# EAGLE schematic 8-Fach-PCB v26 (EAGLE 9.7.0)
Assembly variants: top, bottom
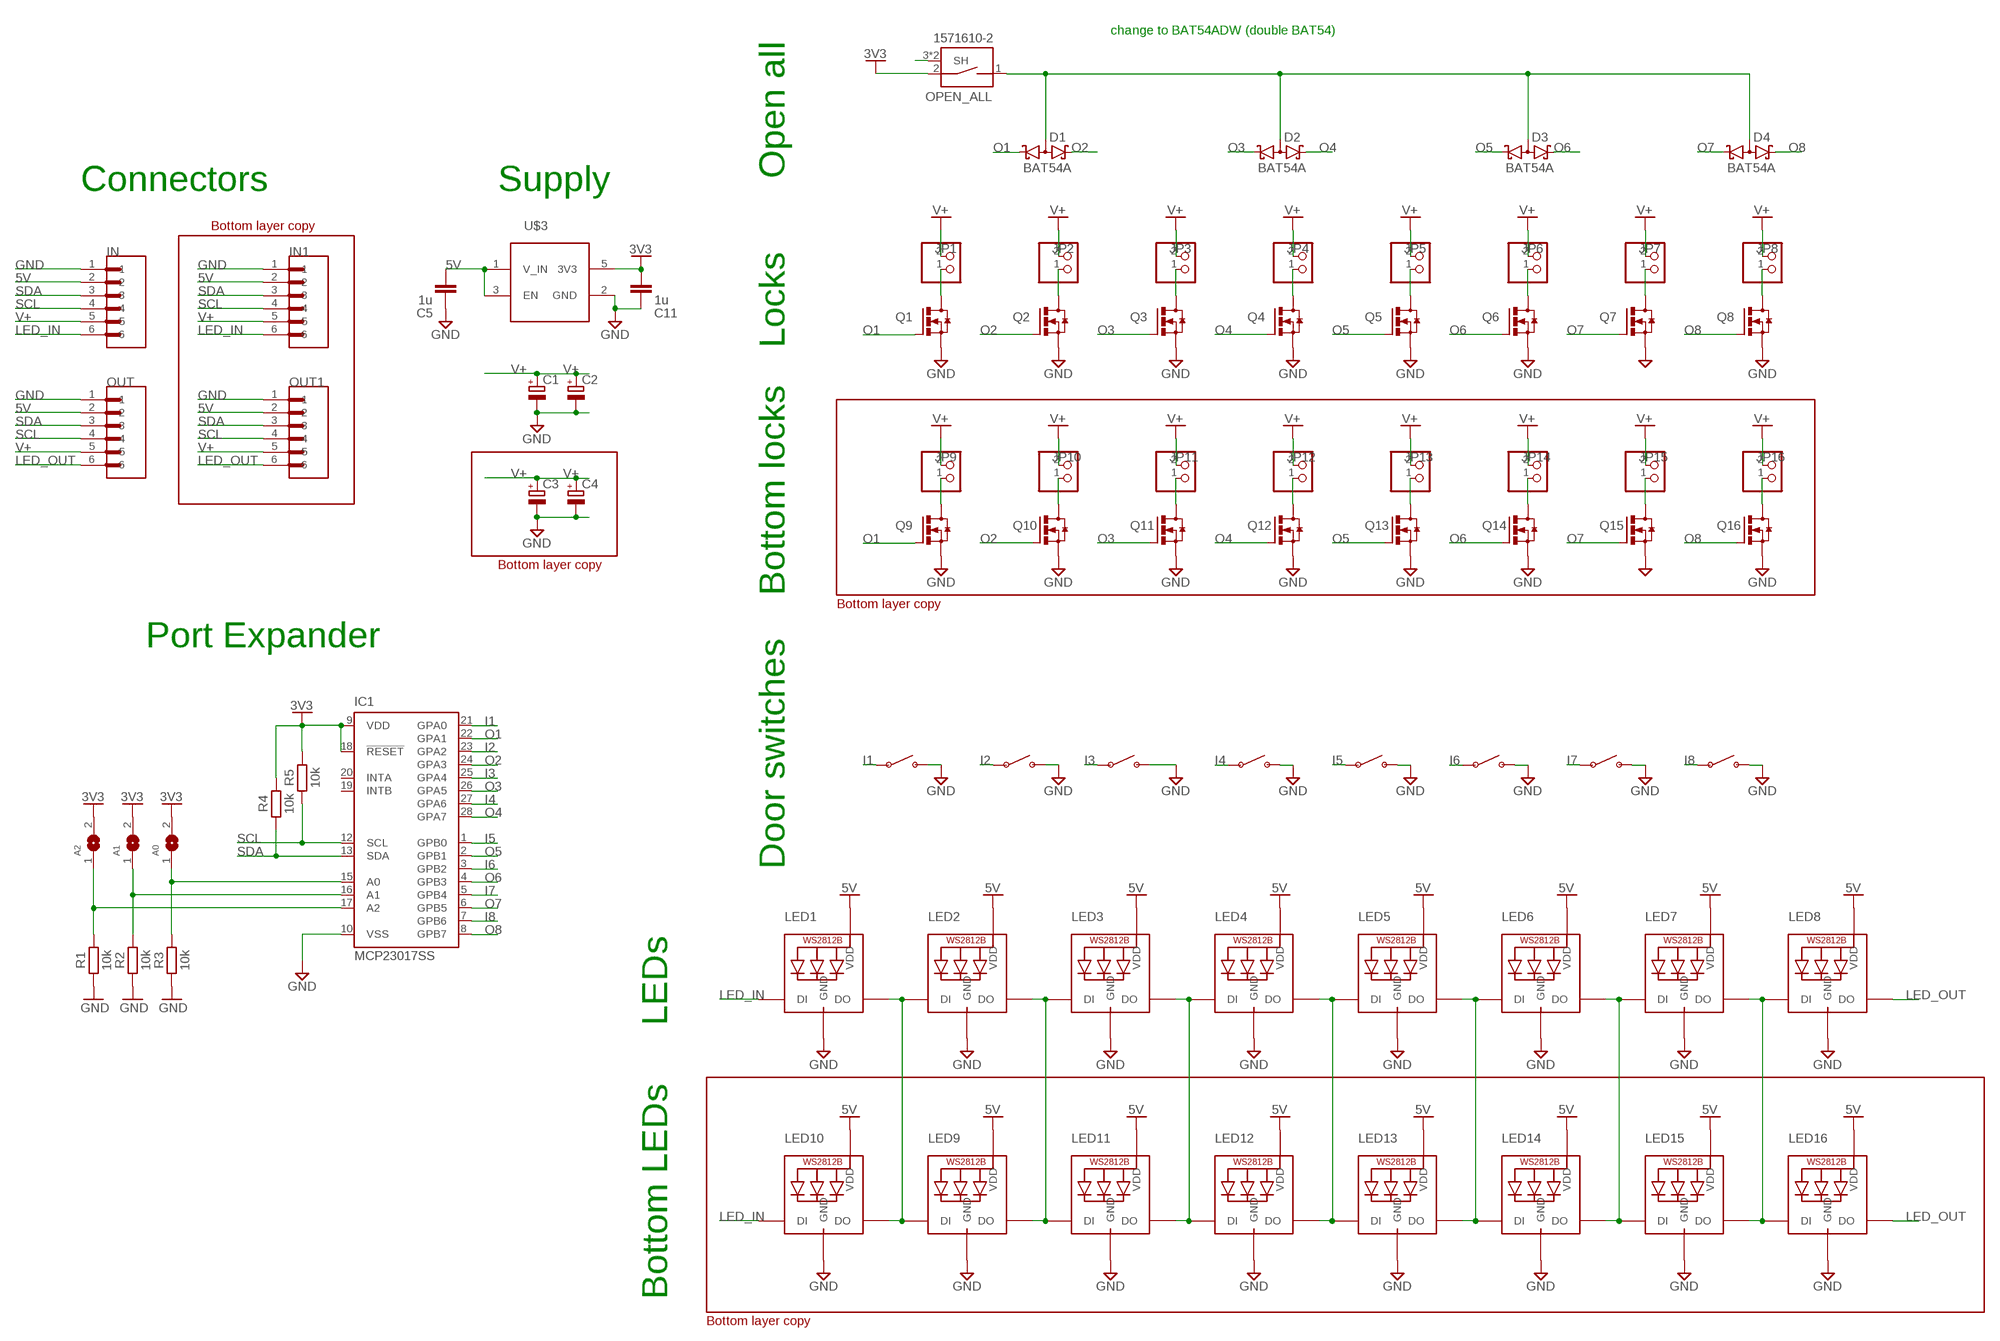
[diagram p0: schematic, sheet 1]

## Parts
A0  SOLDERJUMPER  [SOLDERJUMPER_ARROW_NOPASTE]
A1  SOLDERJUMPER  [SOLDERJUMPER_ARROW_NOPASTE]
A2  SOLDERJUMPER  [SOLDERJUMPER_ARROW_NOPASTE]
C1  C-POL_ECAP-8.5MM  [CAPAE830X1050N]  (not fitted in variant bottom)
C2  C-POL_ECAP-8.5MM  [CAPAE830X1050N]  (not fitted in variant bottom)
C3  C-POL_ECAP-8.5MM  [CAPAE830X1050N]  (not fitted in variant top)
C4  C-POL_ECAP-8.5MM  [CAPAE830X1050N]  (not fitted in variant top)
C5  1u  C_CHIP-0603(1608-METRIC)  [CAPC1608X85]
C11  1u  C_CHIP-0603(1608-METRIC)  [CAPC1608X85]
D1  BAT54A  [SOT23]
D2  BAT54A  [SOT23]
D3  BAT54A  [SOT23]
D4  BAT54A  [SOT23]
IC1  MCP23017SS  [SSOP28]
IN  B6B-PH-SM4-TB(LF)(SN)  [JST_B6B-PH-SM4-TB(LF)(SN)]  (not fitted in variant bottom)
IN1  B6B-PH-SM4-TB(LF)(SN)  [JST_B6B-PH-SM4-TB(LF)(SN)]  (not fitted in variant top)
JP1  JST_2PIN-SMT  [JST-PH-2-SMT]  (not fitted in variant bottom)
JP2  JST_2PIN-SMT  [JST-PH-2-SMT]  (not fitted in variant bottom)
JP3  JST_2PIN-SMT  [JST-PH-2-SMT]  (not fitted in variant bottom)
JP4  JST_2PIN-SMT  [JST-PH-2-SMT]  (not fitted in variant bottom)
JP5  JST_2PIN-SMT  [JST-PH-2-SMT]  (not fitted in variant bottom)
JP6  JST_2PIN-SMT  [JST-PH-2-SMT]  (not fitted in variant bottom)
JP7  JST_2PIN-SMT  [JST-PH-2-SMT]  (not fitted in variant bottom)
JP8  JST_2PIN-SMT  [JST-PH-2-SMT]  (not fitted in variant bottom)
JP9  JST_2PIN-SMT  [JST-PH-2-SMT]  (not fitted in variant top)
JP10  JST_2PIN-SMT  [JST-PH-2-SMT]  (not fitted in variant top)
JP11  JST_2PIN-SMT  [JST-PH-2-SMT]  (not fitted in variant top)
JP12  JST_2PIN-SMT  [JST-PH-2-SMT]  (not fitted in variant top)
JP13  JST_2PIN-SMT  [JST-PH-2-SMT]  (not fitted in variant top)
JP14  JST_2PIN-SMT  [JST-PH-2-SMT]  (not fitted in variant top)
JP15  JST_2PIN-SMT  [JST-PH-2-SMT]  (not fitted in variant top)
JP16  JST_2PIN-SMT  [JST-PH-2-SMT]  (not fitted in variant top)
LED1  SK6812  [4020]
LED2  SK6812  [4020]
LED3  SK6812  [4020]
LED4  SK6812  [4020]
LED5  SK6812  [4020]
LED6  SK6812  [4020]
LED7  SK6812  [4020]
LED8  SK6812  [4020]
LED9  SK6812  [4020]  (not fitted in variant top)
LED10  SK6812  [4020]  (not fitted in variant top)
LED11  SK6812  [4020]  (not fitted in variant top)
LED12  SK6812  [4020]  (not fitted in variant top)
LED13  SK6812  [4020]  (not fitted in variant top)
LED14  SK6812  [4020]  (not fitted in variant top)
LED15  SK6812  [4020]  (not fitted in variant top)
LED16  SK6812  [4020]  (not fitted in variant top)
OPEN_ALL  1571610-2  [1571610-2]
OUT  B6B-PH-SM4-TB(LF)(SN)  [JST_B6B-PH-SM4-TB(LF)(SN)]  (not fitted in variant bottom)
OUT1  B6B-PH-SM4-TB(LF)(SN)  [JST_B6B-PH-SM4-TB(LF)(SN)]  (not fitted in variant top)
Q1  MOSFET-N  [SOT23-3]  (not fitted in variant bottom)
Q2  MOSFET-N  [SOT23-3]  (not fitted in variant bottom)
Q3  MOSFET-N  [SOT23-3]  (not fitted in variant bottom)
Q4  MOSFET-N  [SOT23-3]  (not fitted in variant bottom)
Q5  MOSFET-N  [SOT23-3]  (not fitted in variant bottom)
Q6  MOSFET-N  [SOT23-3]  (not fitted in variant bottom)
Q7  MOSFET-N  [SOT23-3]  (not fitted in variant bottom)
Q8  MOSFET-N  [SOT23-3]  (not fitted in variant bottom)
Q9  MOSFET-N  [SOT23-3]  (not fitted in variant top)
Q10  MOSFET-N  [SOT23-3]  (not fitted in variant top)
Q11  MOSFET-N  [SOT23-3]  (not fitted in variant top)
Q12  MOSFET-N  [SOT23-3]  (not fitted in variant top)
Q13  MOSFET-N  [SOT23-3]  (not fitted in variant top)
Q14  MOSFET-N  [SOT23-3]  (not fitted in variant top)
Q15  MOSFET-N  [SOT23-3]  (not fitted in variant top)
Q16  MOSFET-N  [SOT23-3]  (not fitted in variant top)
R1  10k  R_CHIP-0603(1608-METRIC)  [RESC1608X60]
R2  10k  R_CHIP-0603(1608-METRIC)  [RESC1608X60]
R3  10k  R_CHIP-0603(1608-METRIC)  [RESC1608X60]
R4  10k  R_CHIP-0603(1608-METRIC)  [RESC1608X60]
R5  10k  R_CHIP-0603(1608-METRIC)  [RESC1608X60]
S1  SWITCH_SPST  [OMRON_D2F]
S2  SWITCH_SPST  [OMRON_D2F]
S3  SWITCH_SPST  [OMRON_D2F]
S4  SWITCH_SPST  [OMRON_D2F]
S5  SWITCH_SPST  [OMRON_D2F]
S6  SWITCH_SPST  [OMRON_D2F]
S7  SWITCH_SPST  [OMRON_D2F]
S8  SWITCH_SPST  [OMRON_D2F]
U$3  MIC550XSOT-23-5  [SOT23-5]

## Nets
3V3: A0.2 A1.2 A2.2 C11.2 IC1.9(VDD) IC1.18(!RESET) OPEN_ALL.2 R4.2 R5.2 U$3.5(3V3)
5V: C5.2 IN1.2 IN.2 LED1.VDD LED2.VDD LED3.VDD LED4.VDD LED5.VDD LED6.VDD LED7.VDD LED8.VDD LED9.VDD LED10.VDD LED11.VDD LED12.VDD LED13.VDD LED14.VDD LED15.VDD LED16.VDD OUT1.2 OUT.2 U$3.1(V_IN) U$3.3(EN)
A0: A0.1 IC1.15(A0) R3.2
A1: A1.1 IC1.16(A1) R2.2
A2: A2.1 IC1.17(A2) R1.2
GND: C1.2(-) C2.2(-) C3.2(-) C4.2(-) C5.1 C11.1 IC1.10(VSS) IN1.1 IN.1 LED1.GND LED2.GND LED3.GND LED4.GND LED5.GND LED6.GND LED7.GND LED8.GND LED9.GND LED10.GND LED11.GND LED12.GND LED13.GND LED14.GND LED15.GND LED16.GND OPEN_ALL.3(SH) OPEN_ALL.4(SH) OUT1.1 OUT.1 Q1.2(S) Q2.2(S) Q3.2(S) Q4.2(S) Q5.2(S) Q6.2(S) Q7.2(S) Q8.2(S) Q9.2(S) Q10.2(S) Q11.2(S) Q12.2(S) Q13.2(S) Q14.2(S) Q15.2(S) Q16.2(S) R1.1 R2.1 R3.1 S1.P$2 S2.P$2 S3.P$2 S4.P$2 S5.P$2 S6.P$2 S7.P$2 S8.P$2 U$3.2(GND)
I1: IC1.21(GPA0) S1.P$1
I2: IC1.23(GPA2) S2.P$1
I3: IC1.25(GPA4) S3.P$1
I4: IC1.27(GPA6) S4.P$1
I5: IC1.1(GPB0) S5.P$1
I6: IC1.3(GPB2) S6.P$1
I7: IC1.5(GPB4) S7.P$1
I8: IC1.7(GPB6) S8.P$1
LED_IN: IN1.6 IN.6 LED1.DIN(DI) LED10.DIN(DI)
LED_OUT: LED8.DOUT(DO) LED16.DOUT(DO) OUT1.6 OUT.6
N$1: JP2.1 Q2.3(D)
N$2: D1.3(AA) D2.3(AA) D3.3(AA) D4.3(AA) OPEN_ALL.1
N$3: JP3.1 Q3.3(D)
N$4: JP1.1 Q1.3(D)
N$5: LED7.DOUT(DO) LED8.DIN(DI) LED15.DOUT(DO) LED16.DIN(DI)
N$6: LED6.DOUT(DO) LED7.DIN(DI) LED14.DOUT(DO) LED15.DIN(DI)
N$9: JP4.1 Q4.3(D)
N$10: JP5.1 Q5.3(D)
N$11: JP6.1 Q6.3(D)
N$12: JP7.1 Q7.3(D)
N$13: JP8.1 Q8.3(D)
N$19: JP9.1 Q9.3(D)
N$20: JP10.1 Q10.3(D)
N$21: JP11.1 Q11.3(D)
N$22: JP12.1 Q12.3(D)
N$23: JP13.1 Q13.3(D)
N$24: JP14.1 Q14.3(D)
N$25: JP15.1 Q15.3(D)
N$26: JP16.1 Q16.3(D)
N$32: LED1.DOUT(DO) LED2.DIN(DI) LED9.DIN(DI) LED10.DOUT(DO)
N$34: LED5.DOUT(DO) LED6.DIN(DI) LED13.DOUT(DO) LED14.DIN(DI)
N$35: LED4.DOUT(DO) LED5.DIN(DI) LED12.DOUT(DO) LED13.DIN(DI)
N$36: LED2.DOUT(DO) LED3.DIN(DI) LED9.DOUT(DO) LED11.DIN(DI)
N$37: LED3.DOUT(DO) LED4.DIN(DI) LED11.DOUT(DO) LED12.DIN(DI)
O1: D1.1(K1) IC1.22(GPA1) Q1.1(G) Q9.1(G)
O2: D1.2(K2) IC1.24(GPA3) Q2.1(G) Q10.1(G)
O3: D2.1(K1) IC1.26(GPA5) Q3.1(G) Q11.1(G)
O4: D2.2(K2) IC1.28(GPA7) Q4.1(G) Q12.1(G)
O5: D3.1(K1) IC1.2(GPB1) Q5.1(G) Q13.1(G)
O6: D3.2(K2) IC1.4(GPB3) Q6.1(G) Q14.1(G)
O7: D4.1(K1) IC1.6(GPB5) Q7.1(G) Q15.1(G)
O8: D4.2(K2) IC1.8(GPB7) Q8.1(G) Q16.1(G)
SCL: IC1.12(SCL) IN1.4 IN.4 OUT1.4 OUT.4 R5.1
SDA: IC1.13(SDA) IN1.3 IN.3 OUT1.3 OUT.3 R4.1
V+: C1.1(+) C2.1(+) C3.1(+) C4.1(+) IN1.5 IN.5 JP1.2 JP2.2 JP3.2 JP4.2 JP5.2 JP6.2 JP7.2 JP8.2 JP9.2 JP10.2 JP11.2 JP12.2 JP13.2 JP14.2 JP15.2 JP16.2 OUT1.5 OUT.5
Unconnected: IC1.19(INTB) IC1.20(INTA)

## Notes on the sheet
- change to BAT54ADW (double BAT54)
- Open all
- Connectors | Supply
- Bottom layer copy
- Locks
- Bottom layer copy
- Bottom locks
- Bottom layer copy
- Port Expander
- Door switches
- LEDs
- Bottom LEDs
- Bottom layer copy

## Library data of the parts
A0 A1 A2 = microbuilder:SOLDERJUMPER: SMD Solder JUMPER Solder the two pads together to create a connection, or remove the solder to break it. REFLOW - Use this footprint for solder paste and reflow ovens. WAVE - Use this footprint for hand-soldering (larger pads). CLOSED - Has a trace between the two pads to ensure it is closed by default. The trace needs to be cut to disable the jumper, and can be closed again by creating a solder bridge between the two pads.; BOM: EXCLUDE
C1-C4 = Capacitor:C-POL: Capacitor Polarised - Generic; CATEGORY: Capacitor
C5 C11 = Capacitor:C: Capacitor - Generic; CATEGORY: Capacitor
D1-D4 = diode:BAT54A: Schottky Diodes Source: Fairchild .. BAT54.pdf
IC1 = adafruit:MCP23017: http://ww1.microchip.com/downloads/en/DeviceDoc/21952a.pdf Source: http://ww1.microchip.com/downloads/en/DeviceDoc/21952a.pdf
IN IN1 OUT OUT1 = B6B-PH-SM4-TB_LF__SN_:B6B-PH-SM4-TB(LF)(SN): PH Series 2 mm Pitch 6 Position SMT Single Row Top Entry Shrouded Header; MANUFACTURER: JST
JP1-JP16 = MAS AT PCB library v11:JST_2PIN: JST 2-Pin Connectors of various flavors SMT-RA (S2B-PH-SM4) 4UConnector #17311 SMT (B2B-PH-SM4) THM-RA (S2B-PH) THM (B2B-PH)
LED1-LED16 = MAS AT PCB library v11:SK6812
OPEN_ALL = Switch:1571610-2: SWITCH TACTILE SPST-NO 0.05A 24V Manufacturer's datasheet <https://www.te.com/commerce/DocumentDelivery/DDEController?Action=srchrtrv&DocNm=1571610&DocType=Customer+Drawing&DocLang=English>; CREATED_BY: PCBLayout.com; DIGIKEY_PN: A117269-ND; MANUFACTURER: TE Connectivity ALCOSWITCH Switches; MPN: 1571610-2
Q1-Q16 = MAS AT PCB library:MOSFET-N: MOSFET N-CH 60V 300MA SOT-23 Manufacturer's datasheet <https://assets.nexperia.com/documents/data-sheet/2N7002.pdf>; CREATED_BY: PCBLayout.com; DIGIKEY_PART_NUMBER: 1727-2764-1-ND; MANUFACTURER: Nexperia USA Inc.; MPN: 2N7002,215; PACKAGE: SOT-23-3
R1-R5 = Resistor:R: Resistor Fixed - Generic; CATEGORY: Resistor; SUB-CATEGORY: Fixed
S1-S8 = ZE PCB lib v51:SWITCH_SPST
U$3 = MAS AT PCB library v11:MIC550X